# EAGLE schematic pcm5102_dac (EAGLE 9.5.1)
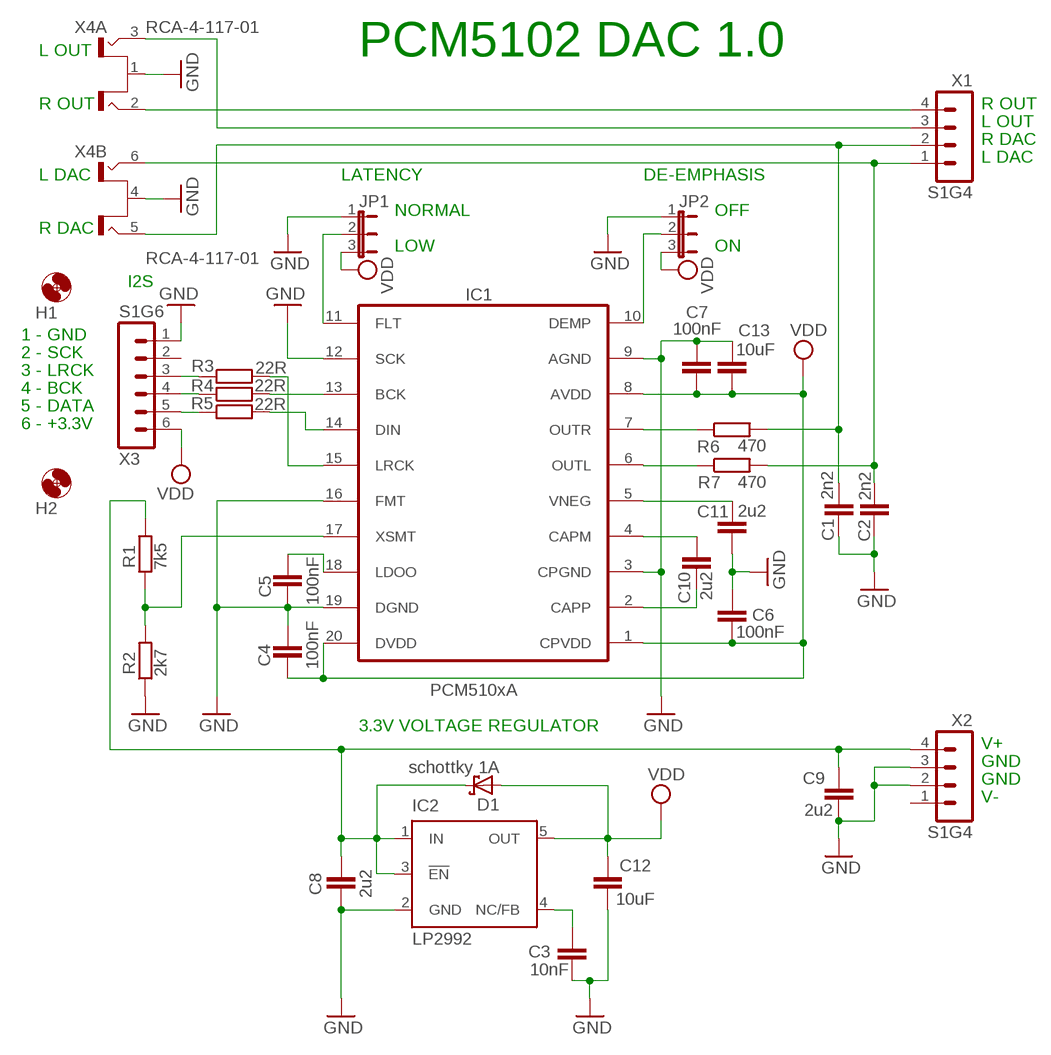
[diagram p0: schematic, sheet 1]

## Parts
C1  2n2  C-EUC1206  [C1206]
C2  2n2  C-EUC1206  [C1206]
C3  10nF  C-EUC1812  [C1812]
C4  100nF  C-EUC1206  [C1206]
C5  100nF  C-EUC1206  [C1206]
C6  100nF  C-EUC1206  [C1206]
C7  100nF  C-EUC1206  [C1206]
C8  2u2  C-EUC1206  [C1206]
C9  2u2  C-EUC1206  [C1206]
C10  2u2  C-EUC1206  [C1206]
C11  2u2  C-EUC1206  [C1206]
C12  10uF  C-EUC1206  [C1206]
C13  10uF  C-EUC1206  [C1206]
D1  schottky 1A  SCHOTTKY-DIODESMD  [SMB]
H1  MOUNT-HOLE3.2  [3,2]
H2  MOUNT-HOLE3.2  [3,2]
IC1  PCM510xA  PCM510X  [TSSOP20]
IC2  LP2992  TPS77001  [SOT23-DBV]
JP1  DIL  JP2E  [JP2]
JP2  DIL  JP2E  [JP2]
R1  7k5  R-EU_R1206  [R1206]
R2  2k7  R-EU_R1206  [R1206]
R3  22R  R-EU_R1206  [R1206]
R4  22R  R-EU_R1206  [R1206]
R5  22R  R-EU_R1206  [R1206]
R6  470  R-EU_R1206  [R1206]
R7  470  R-EU_R1206  [R1206]
X1  S1G4  MA04-1  [MA04-1]
X2  S1G4  MA04-1  [MA04-1]
X3  S1G6  MA06-1  [MA06-1]
X4  RCA-4-117-01  [RCA-4-117-01]

## Nets
GND: C1.2 C2.2 C3.2 C4.1 C5.2 C6.1 C7.1 C8.2 C9.2 C11.2 C12.2 C13.1 IC1.3(CPGND) IC1.9(AGND) IC1.12(SCK) IC1.16(FMT) IC1.19(DGND) IC2.2(GND) JP1.1 JP2.1 R2.1 X2.2 X2.3 X3.1 X4.1(A:S) X4.4(B:S)
LDOO: C5.1 IC1.18(LDOO)
N$1: R5.1 X3.5
N$2: C8.1 C9.1 D1.C IC2.1(IN) IC2.3(!EN) R1.2 X2.4
N$3: X1.3 X4.3(A:T2)
N$4: C3.1 IC2.4(NC/FB)
N$5: IC1.17(XSMT) R1.1 R2.2
N$6: X1.4 X4.2(A:T1)
N$7: C2.1 R7.2 X1.1 X4.6(B:T2)
N$8: R3.1 X3.3
N$9: R4.1 X3.4
N$10: IC1.13(BCK) R4.2
N$11: IC1.14(DIN) R5.2
N$12: IC1.11(FLT) JP1.2
N$13: IC1.10(DEMP) JP2.2
N$34: IC1.15(LRCK) R3.2
N$43: C10.1 IC1.4(CAPM)
N$46: C10.2 IC1.2(CAPP)
N$47: C11.1 IC1.5(VNEG)
N$48: IC1.7(OUTR) R6.1
N$49: IC1.6(OUTL) R7.1
N$51: C1.1 R6.2 X1.2 X4.5(B:T1)
VDD: C4.2 C6.2 C7.2 C12.1 C13.2 D1.A IC1.1(CPVDD) IC1.8(AVDD) IC1.20(DVDD) IC2.5(OUT) JP1.3 JP2.3 X3.6
Unconnected: X2.1 X3.2

## Notes on the sheet
- L OUT | PCM5102 DAC 1.0
- R OUT | R OUT
- L OUT
- R DAC
- L DAC
- L DAC | LATENCY | DE-EMPHASIS
- NORMAL | OFF
- R DAC
- LOW | ON
- I2S
- 1 - GND
- 2 - SCK
- 3 - LRCK
- 4 - BCK
- 5 - DATA
- 6 - +3.3V
- 3.3V VOLTAGE REGULATOR
- V+
- GND
- GND
- V-

## Library data of the parts
C1-C13 = rcl:C-EU: CAPACITOR, European symbol
D1 = diode:SCHOTTKY-DIODE: Schottky Diode
H1 H2 = holes:MOUNT-HOLE: MOUNTING HOLE with drill center marker
IC1 = pavouk:PCM510X: 2VRMS DirectPath™, 112/106/100dB Audio Stereo DAC with 32-bit, 384kHz PCM Interface
IC2 = texas:TPS770*: ULTRALOW-POWER 50-mA LOW-DROPOUT LINEAR REGULATORS 50-mA Low-Dropout Regulator Source: http://focus.ti.com/lit/ds/symlink/tps77001.pdf; MF: TEXAS INSTRUMENTS; MPN: TPS77001DBVT; OC_FARNELL: 8461554; OC_NEWARK: 77C1171
JP1 JP2 = jumper:JP2E: JUMPER
R1-R7 = rcl:R-EU_: RESISTOR, European symbol
X1 X2 = con-lstb:MA04-1: PIN HEADER; OC_FARNELL: unknown; OC_NEWARK: unknown
X3 = con-lstb:MA06-1: PIN HEADER; OC_FARNELL: unknown; OC_NEWARK: unknown
X4 = con-conrad:RCA-4-117-01: Cinch-Anschlussplatte 72385 Gold, Rot, Weiß BKL Electronic Conrad Bestellnummer : 736910 - 62 Source: Data sheet <http://www.produktinfo.conrad.com/datenblaetter/725000-749999/736910-da-01-en-Cinch_Anschlussplatte_4polig.pdf>